# Altium schematic sheet DC-DC_30KW_BUCK-BOOST.SchDoc
size 1399 x 900 mm; SheetNumber: 1; SheetTotal: 1; SPICEModelCachePRJWMUZL: <root> / <DocumentId>PRJWMUZL</DocumentId> / <CacheFrame Number="0"> / <Model Name="7850_74477530_1m" Kind="CKT"> / <Text>******* / .subckt 7850_74477530_1m 1 2 / Rp 1 2 187304.915771 / Cp 1 2 4.36976277949p / Rs 1 N3 3.3 / L1 N3 2 1000u / .ends 7850_74477530_1m</Text> / </Model> / </CacheFrame> / </root>
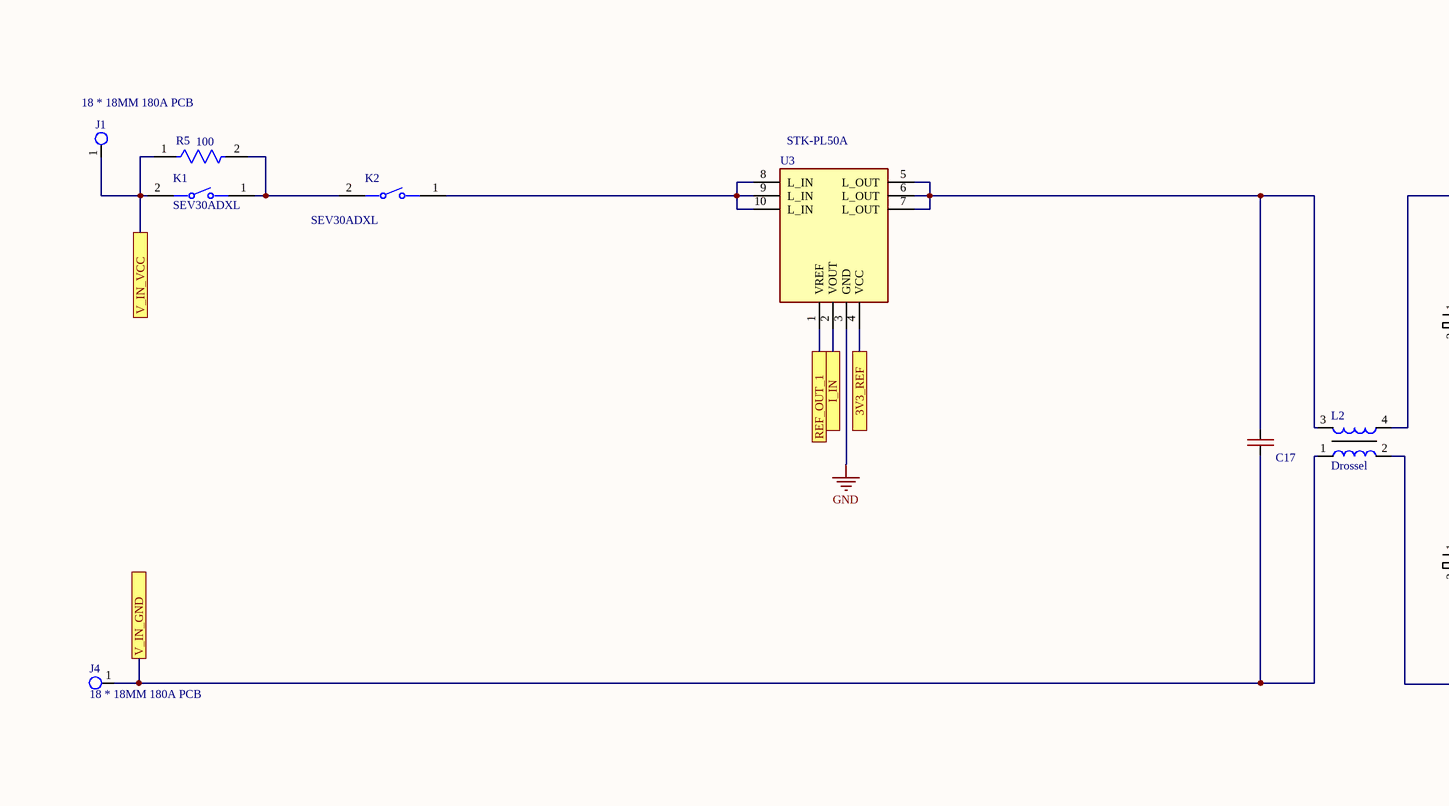
[diagram p0: DC-DC_30KW_BUCK-BOOST.SchDoc, top column 1 of 4]
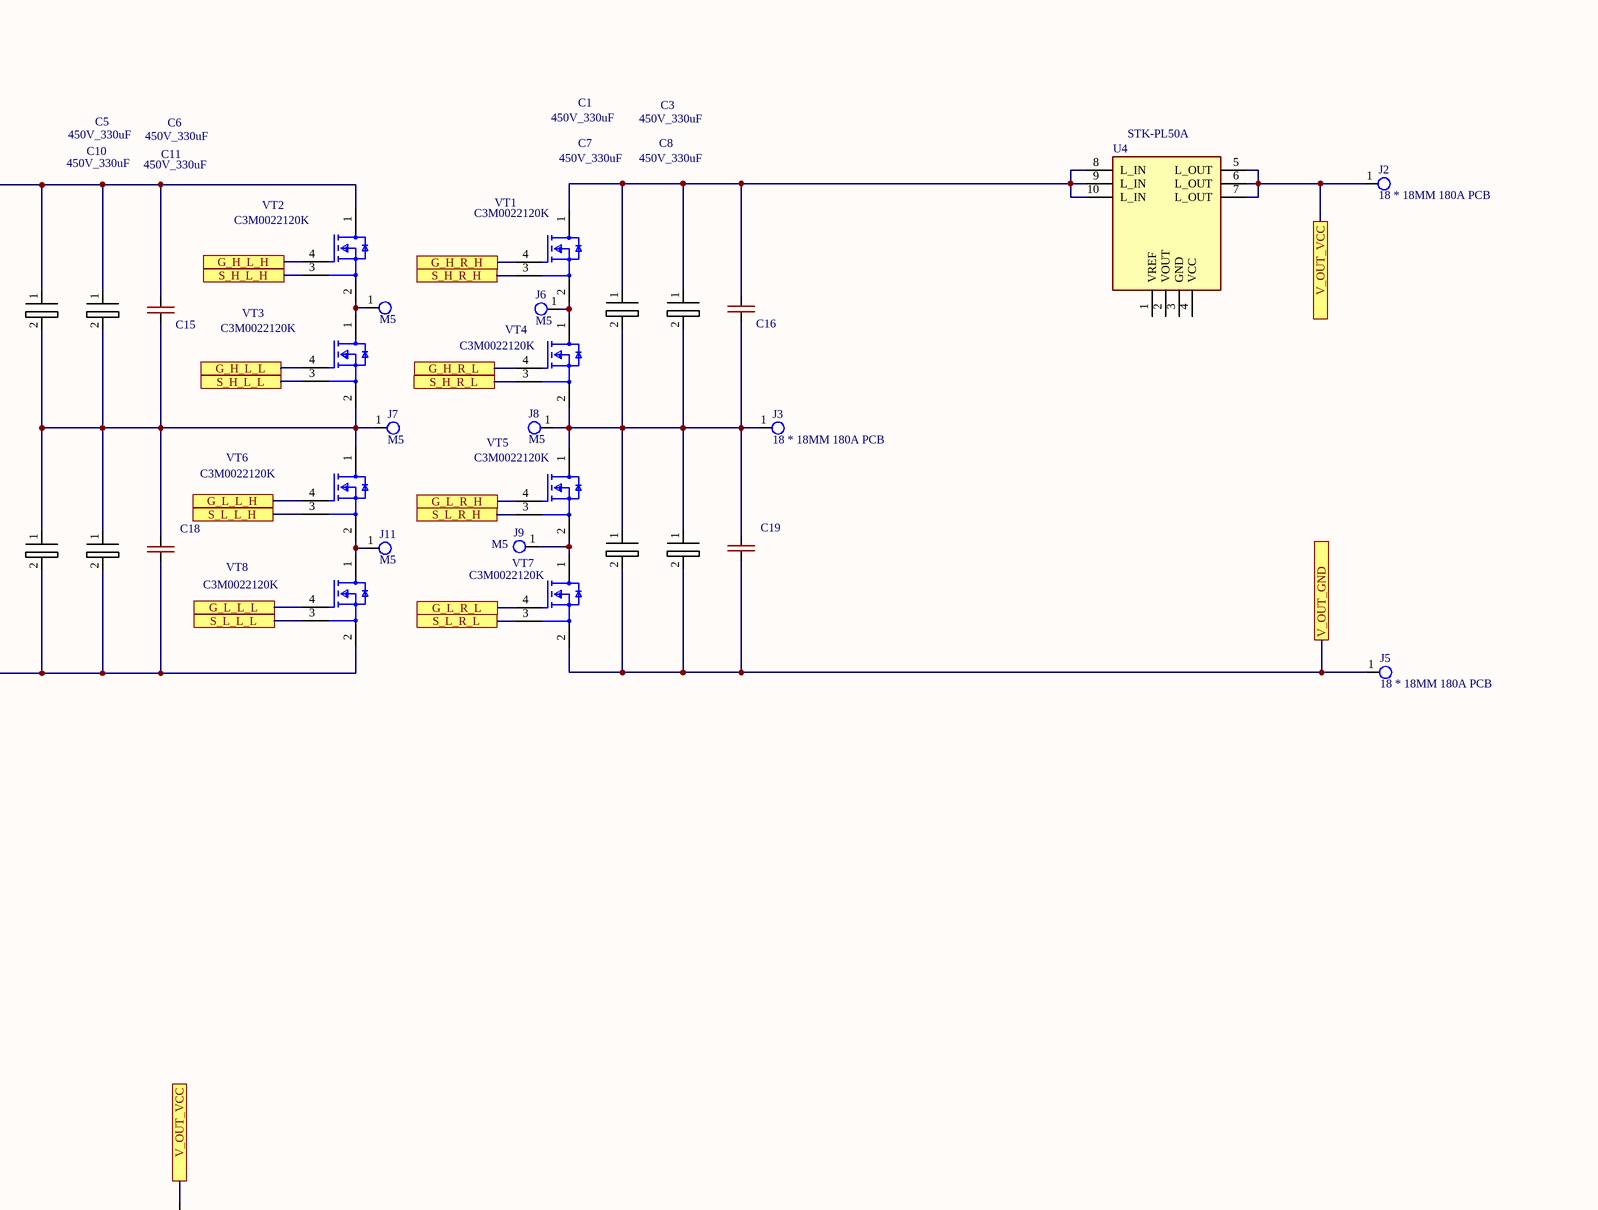
[diagram p1: DC-DC_30KW_BUCK-BOOST.SchDoc, top column 2 of 4]
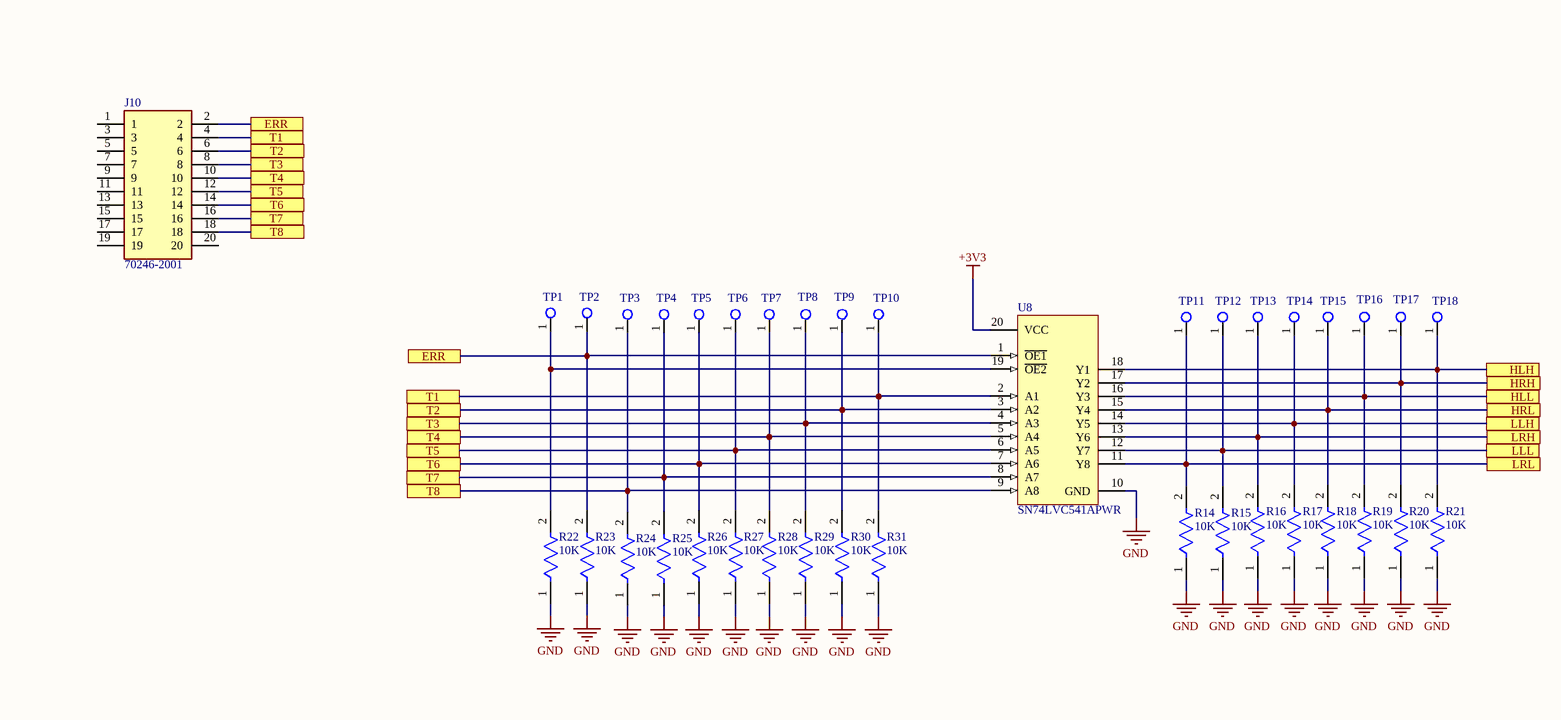
[diagram p2: DC-DC_30KW_BUCK-BOOST.SchDoc, top column 3 of 4]
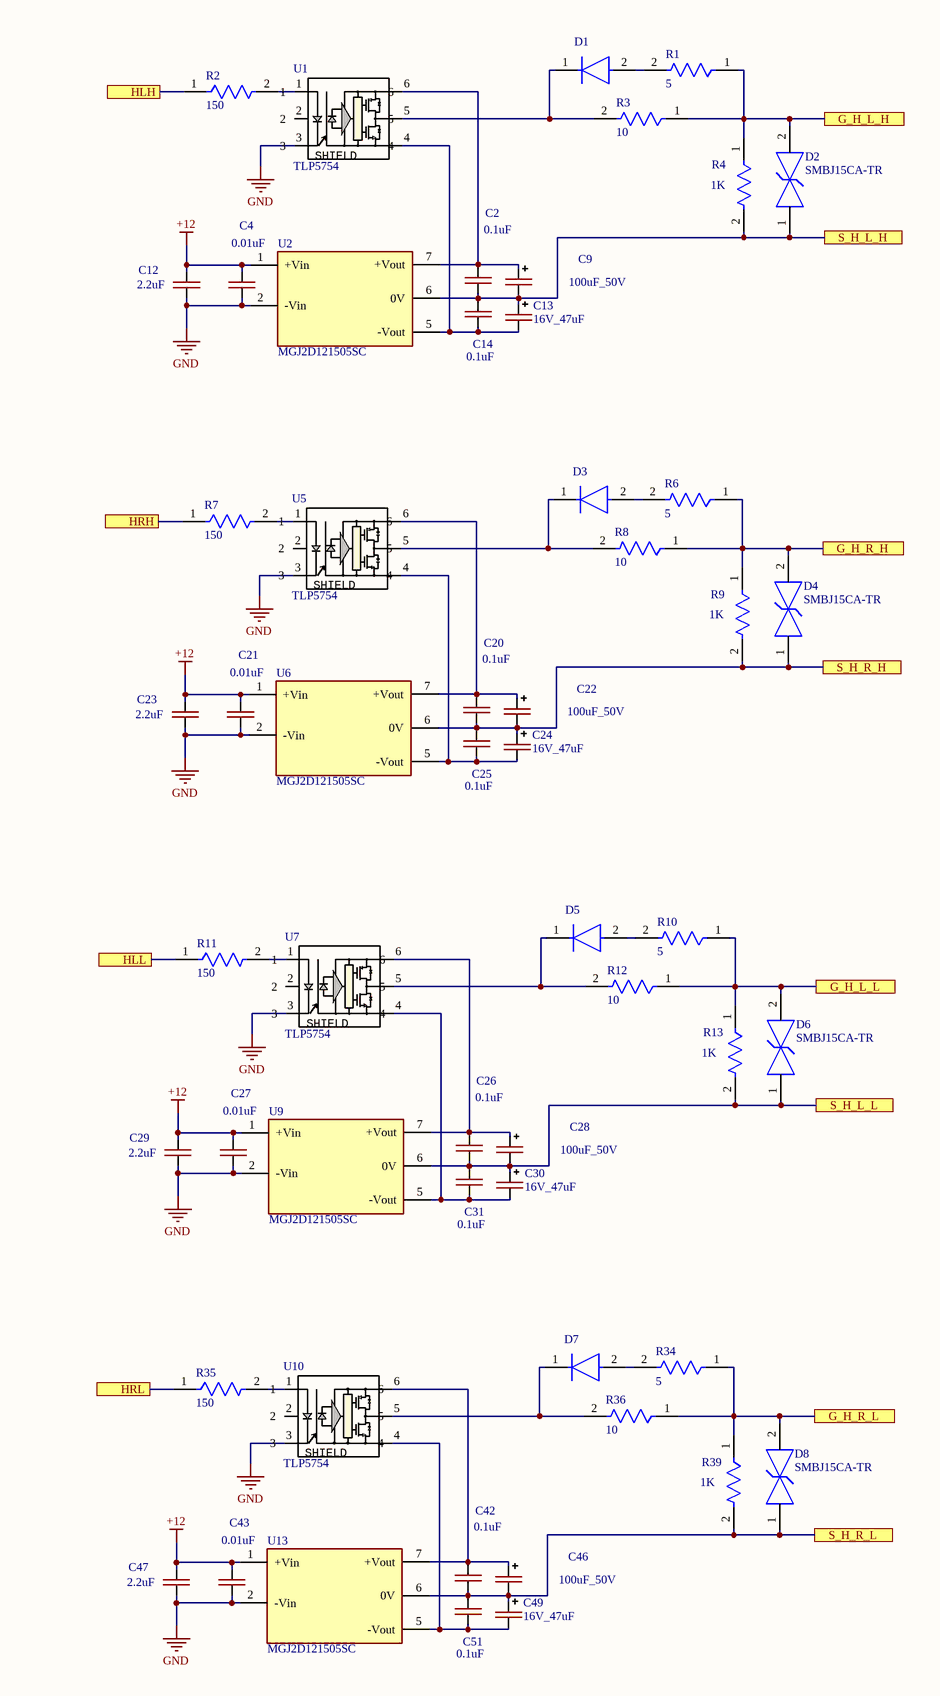
[diagram p3: DC-DC_30KW_BUCK-BOOST.SchDoc, top column 4 of 4]
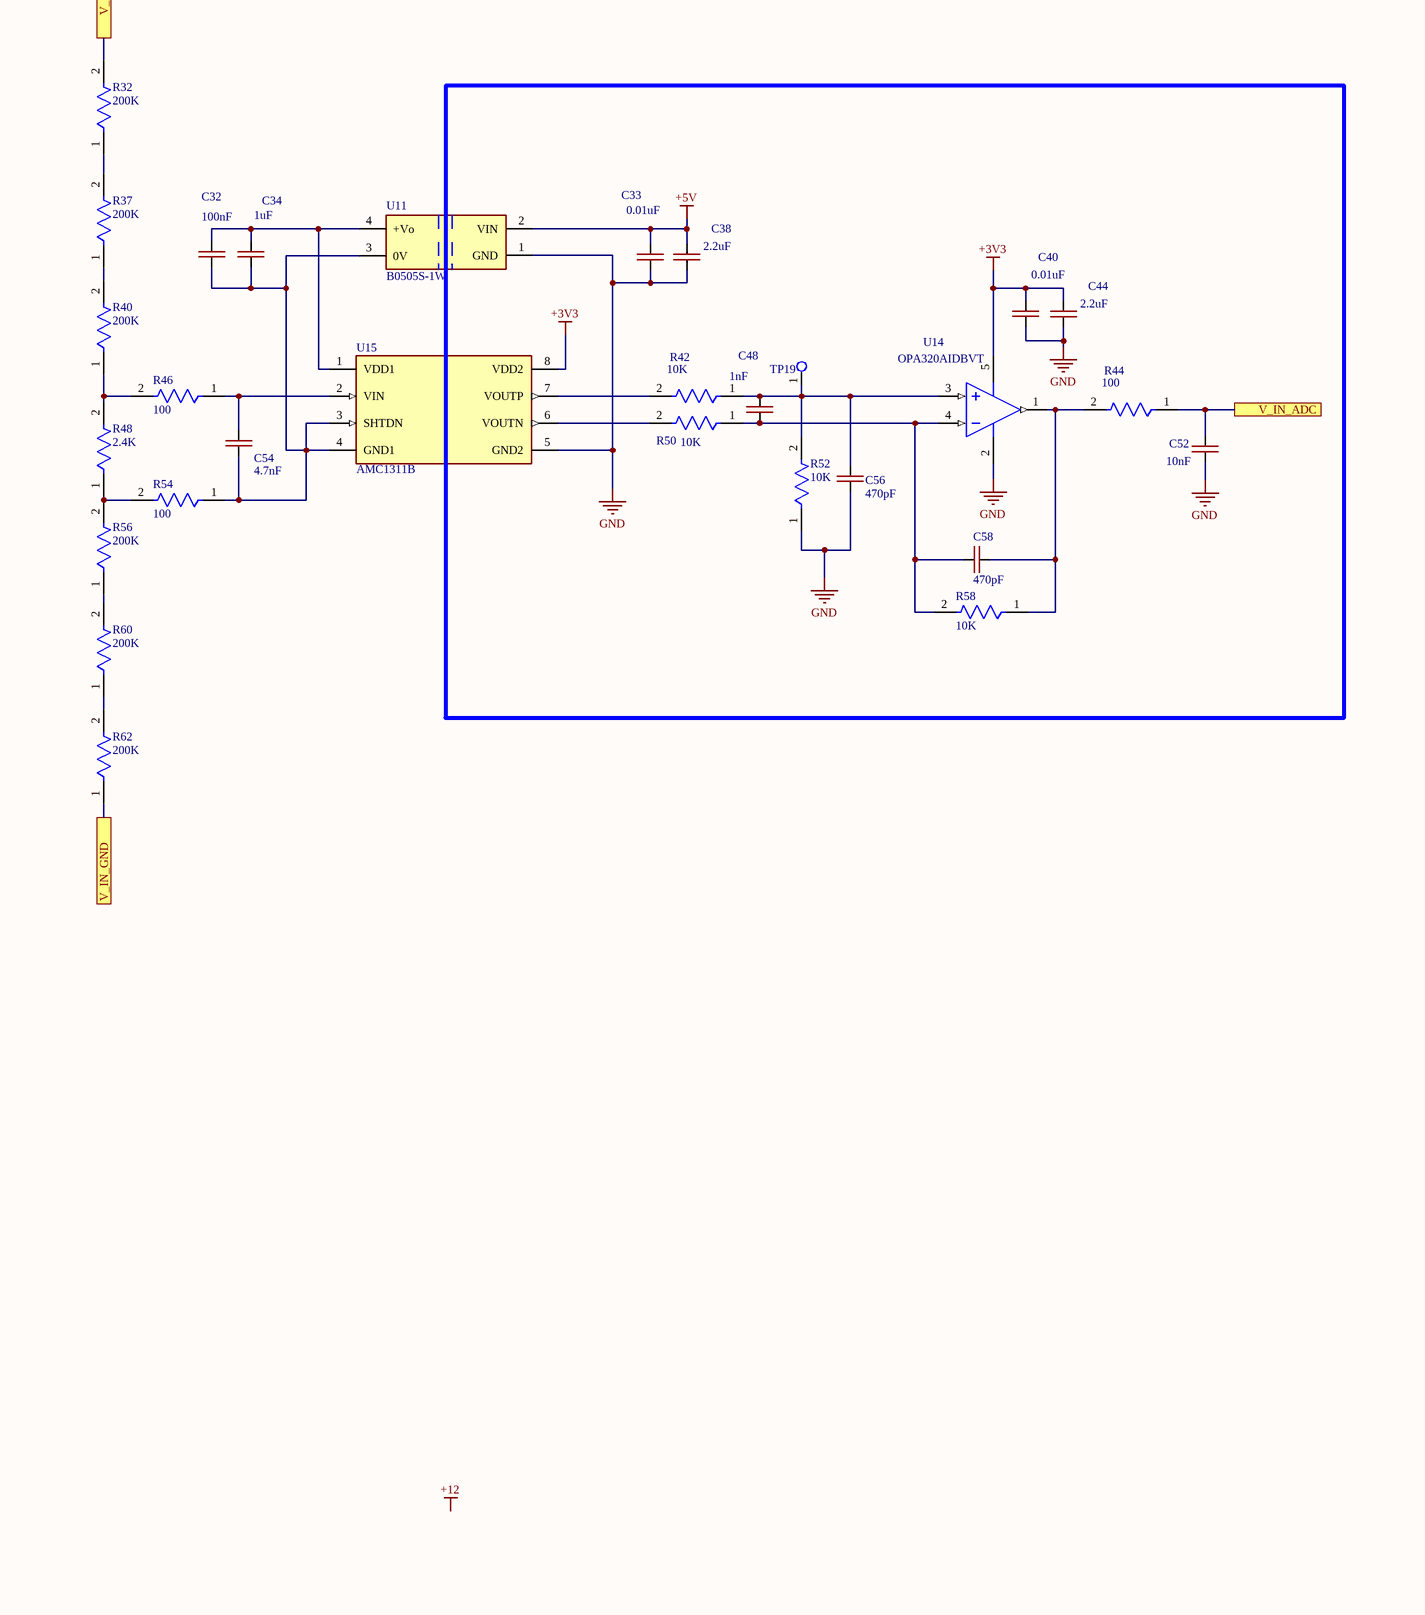
[diagram p4: DC-DC_30KW_BUCK-BOOST.SchDoc, centre column 1 of 4]
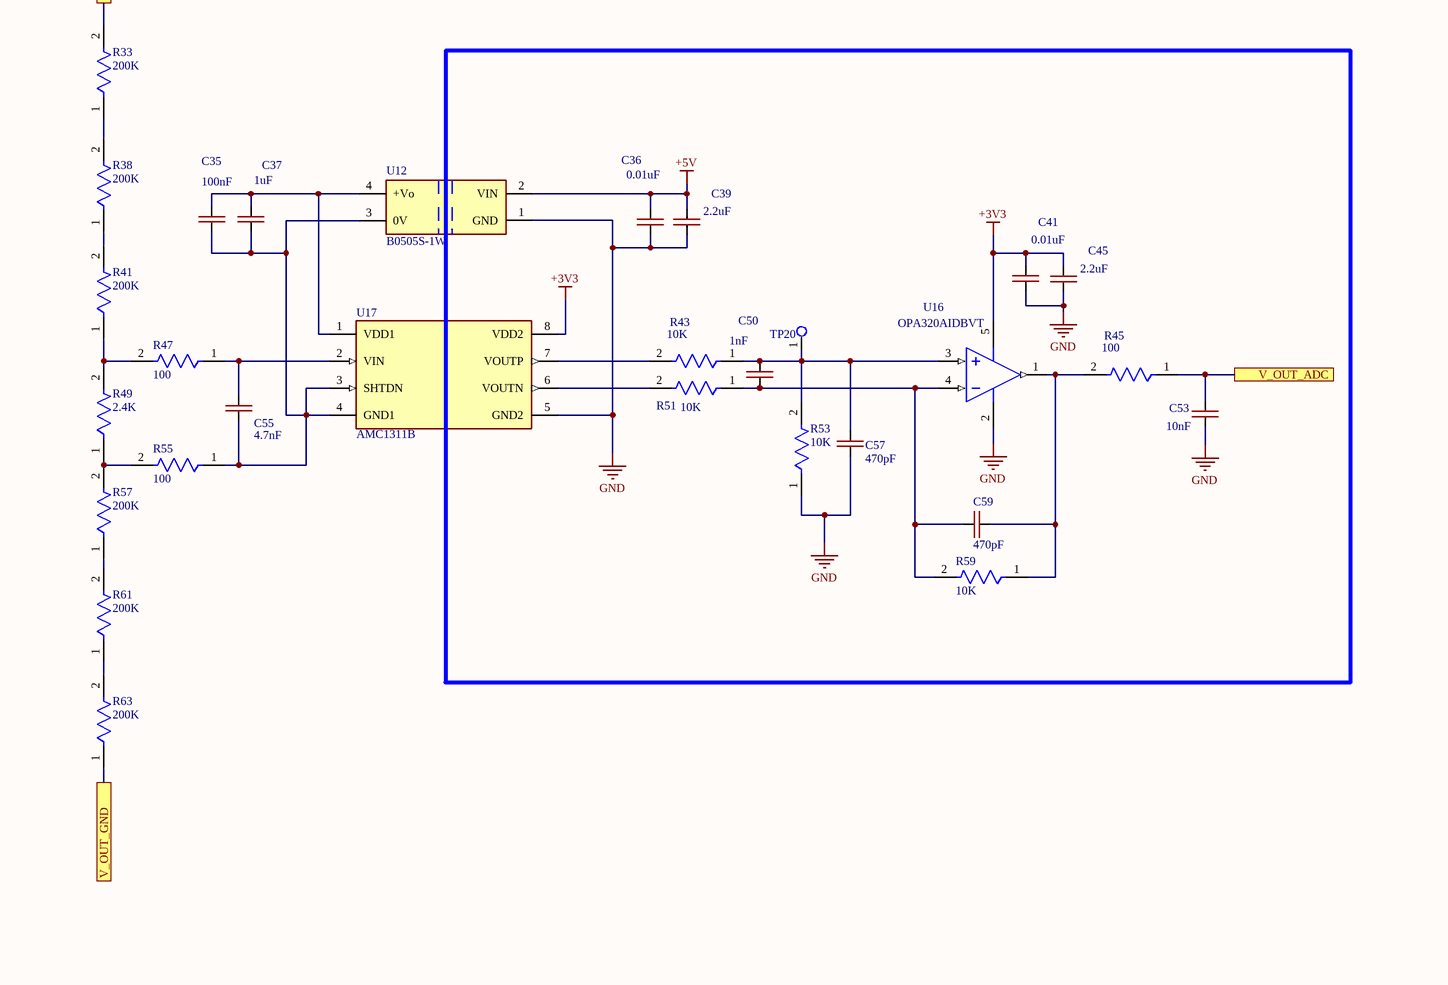
[diagram p5: DC-DC_30KW_BUCK-BOOST.SchDoc, centre column 2 of 4]
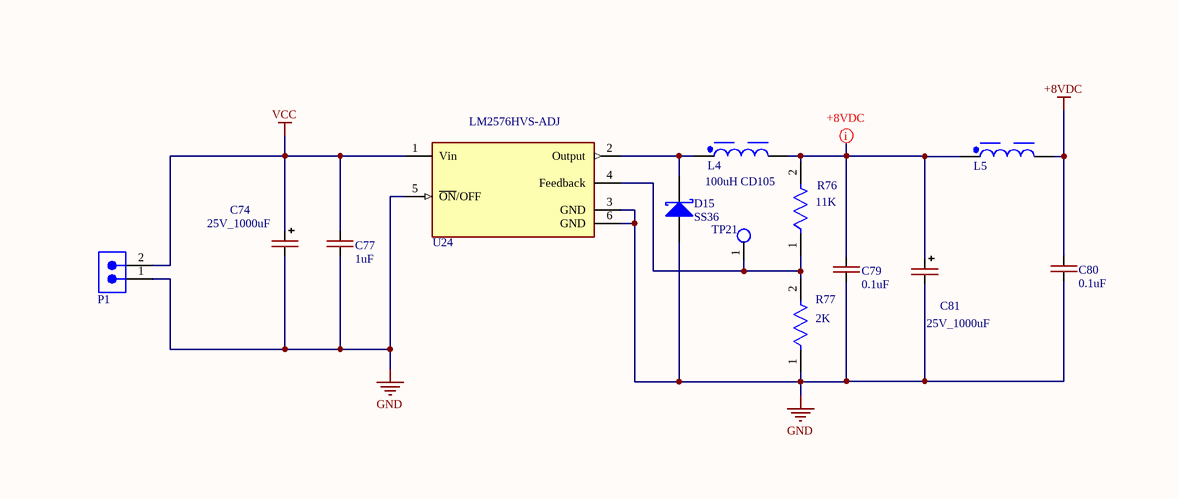
[diagram p6: DC-DC_30KW_BUCK-BOOST.SchDoc, centre column 3 of 4]
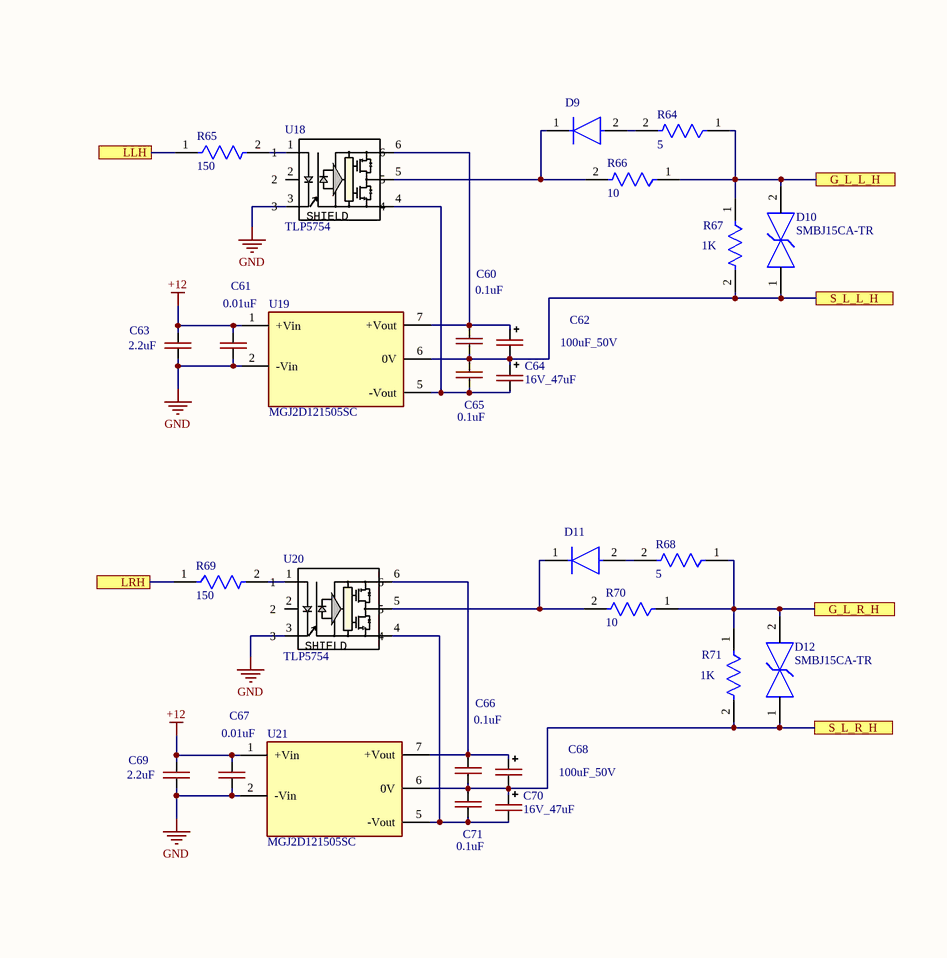
[diagram p7: DC-DC_30KW_BUCK-BOOST.SchDoc, centre column 4 of 4]
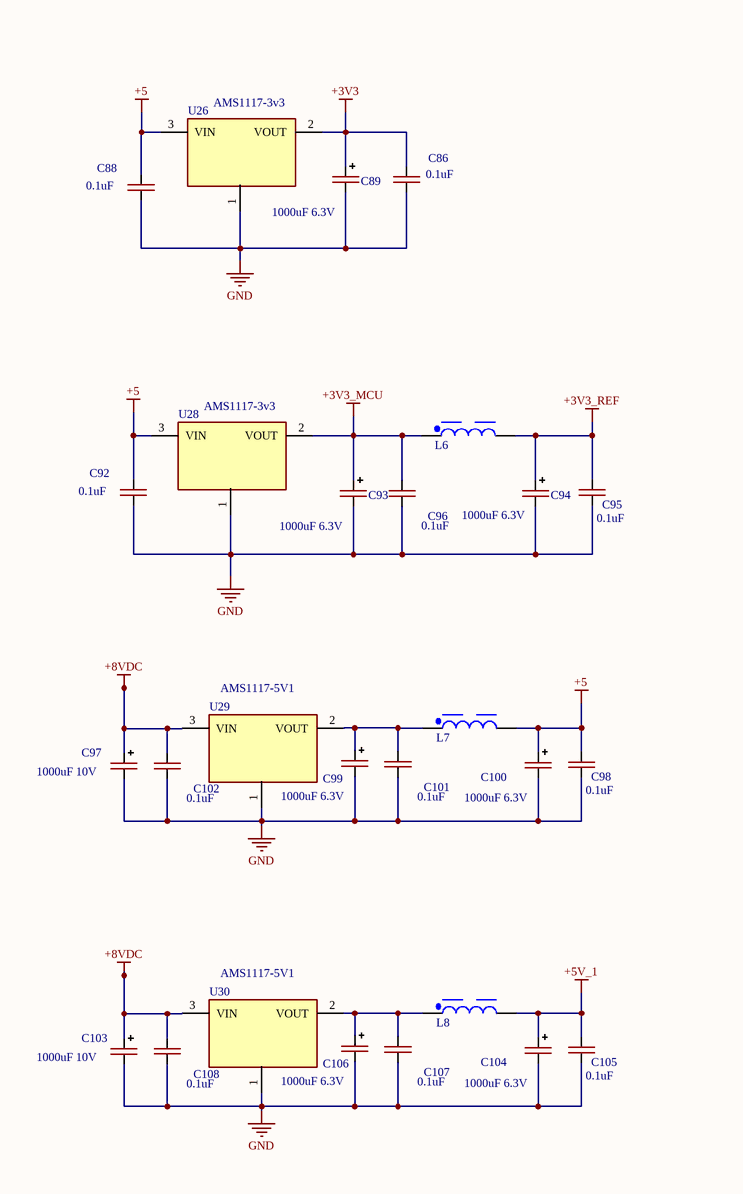
[diagram p8: DC-DC_30KW_BUCK-BOOST.SchDoc, bottom column 1 of 4]
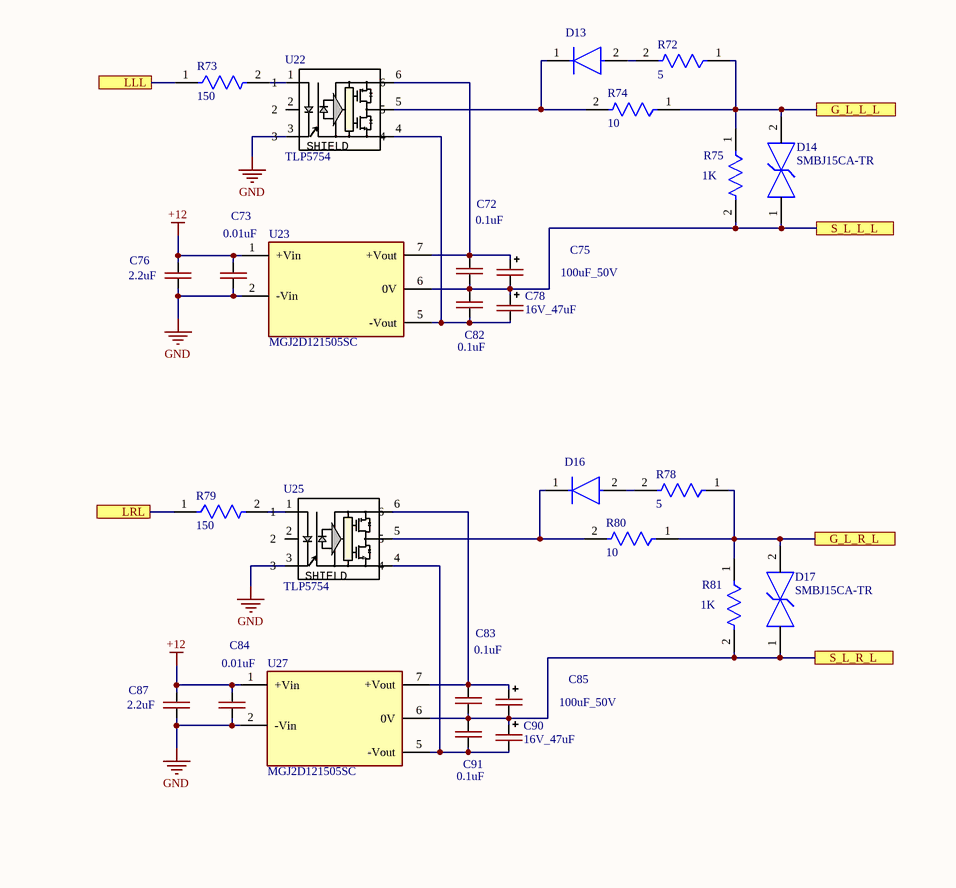
[diagram p9: DC-DC_30KW_BUCK-BOOST.SchDoc, bottom column 4 of 4]

## Parts
C1  450V_330uF  [500V_470uF]
C2  0.1uF  [CAP-0805]
C3  450V_330uF  [500V_470uF]
C4  0.01uF  [CAP-0805]
C5  450V_330uF  [500V_470uF]
C6  450V_330uF  [500V_470uF]
C7  450V_330uF  [500V_470uF]
C8  450V_330uF  [500V_470uF]
C9  100uF_50V  [CAP_SMD_Size_E]
C10  450V_330uF  [500V_470uF]
C11  450V_330uF  [500V_470uF]
C12  2.2uF  [CAP-0805]
C13  16V_47uF  [CAP-TAN-C]
C14  0.1uF  [CAP-0805]
C15  CAP-NON-POLAR  [CAP_4.7uF_630V]  (value not drawn)
C16  CAP-NON-POLAR  [CAP_4.7uF_630V]  (value not drawn)
C17  CAP-NON-POLAR  [Z121578672 77G]  (value not drawn)
C18  CAP-NON-POLAR  [CAP_4.7uF_630V]  (value not drawn)
C19  CAP-NON-POLAR  [CAP_4.7uF_630V]  (value not drawn)
C20  0.1uF  [CAP-0805]
C21  0.01uF  [CAP-0805]
C22  100uF_50V  [CAP_SMD_Size_E]
C23  2.2uF  [CAP-0805]
C24  16V_47uF  [CAP-TAN-C]
C25  0.1uF  [CAP-0805]
C26  0.1uF  [CAP-0805]
C27  0.01uF  [CAP-0805]
C28  100uF_50V  [CAP_SMD_Size_E]
C29  2.2uF  [CAP-0805]
C30  16V_47uF  [CAP-TAN-C]
C31  0.1uF  [CAP-0805]
C32  100nF  [CAP-0603]
C33  0.01uF  [CAP-0603]
C34  1uF  [CAP-0603]
C35  100nF  [CAP-0603]
C36  0.01uF  [CAP-0603]
C37  1uF  [CAP-0603]
C38  2.2uF  [CAP-0603]
C39  2.2uF  [CAP-0603]
C40  0.01uF  [CAP-0603]
C41  0.01uF  [CAP-0603]
C42  0.1uF  [CAP-0805]
C43  0.01uF  [CAP-0805]
C44  2.2uF  [CAP-0603]
C45  2.2uF  [CAP-0603]
C46  100uF_50V  [CAP_SMD_Size_E]
C47  2.2uF  [CAP-0805]
C48  1nF  [CAP-0805]
C49  16V_47uF  [CAP-TAN-C]
C50  1nF  [CAP-0805]
C51  0.1uF  [CAP-0805]
C52  10nF  [CAP-0805]
C53  10nF  [CAP-0805]
C54  4.7nF  [CAP-0603]
C55  4.7nF  [CAP-0603]
C56  470pF  [CAP-0805]
C57  470pF  [CAP-0805]
C58  470pF  [CAP-0805]
C59  470pF  [CAP-0805]
C60  0.1uF  [CAP-0805]
C61  0.01uF  [CAP-0805]
C62  100uF_50V  [CAP_SMD_Size_E]
C63  2.2uF  [CAP-0805]
C64  16V_47uF  [CAP-TAN-C]
C65  0.1uF  [CAP-0805]
C66  0.1uF  [CAP-0805]
C67  0.01uF  [CAP-0805]
C68  100uF_50V  [CAP_SMD_Size_E]
C69  2.2uF  [CAP-0805]
C70  16V_47uF  [CAP-TAN-C]
C71  0.1uF  [CAP-0805]
C72  0.1uF  [CAP-0805]
C73  0.01uF  [CAP-0805]
C74  25V_1000uF  [HITANO 3300uF 25V  16x25]
C75  100uF_50V  [CAP_SMD_Size_E]
C76  2.2uF  [CAP-0805]
C77  1uF  [CAP-0805]
C78  16V_47uF  [CAP-TAN-C]
C79  0.1uF  [CAP-0805]
C80  0.1uF  [CAP-0805]
C81  25V_1000uF  [HITANO 3300uF 25V  16x25]
C82  0.1uF  [CAP-0805]
C83  0.1uF  [CAP-0805]
C84  0.01uF  [CAP-0805]
C85  100uF_50V  [CAP_SMD_Size_E]
C86  0.1uF  [CAP-0805]
C87  2.2uF  [CAP-0805]
C88  0.1uF  [CAP-0805]
C89  1000uF 6.3V  [CAP_SMD_Size_E]
C90  16V_47uF  [CAP-TAN-C]
C91  0.1uF  [CAP-0805]
C92  0.1uF  [CAP-0805]
C93  1000uF 6.3V  [CAP_SMD_Size_E]
C94  1000uF 6.3V  [CAP_SMD_Size_E]
C95  0.1uF  [CAP-0805]
C96  0.1uF  [CAP-0805]
C97  1000uF 10V  [CAP_SMD_Size_G]
C98  0.1uF  [CAP-0805]
C99  1000uF 6.3V  [CAP_SMD_Size_E]
C100  1000uF 6.3V  [CAP_SMD_Size_E]
C101  0.1uF  [CAP-0805]
C102  0.1uF  [CAP-0805]
C103  1000uF 10V  [CAP_SMD_Size_G]
C104  1000uF 6.3V  [CAP_SMD_Size_E]
C105  0.1uF  [CAP-0805]
C106  1000uF 6.3V  [CAP_SMD_Size_E]
C107  0.1uF  [CAP-0805]
C108  0.1uF  [CAP-0805]
D1  US1G  [US1G_SMA]  (value not drawn)
D2  SMBJ15CA-TR  [FP-SMB-CA-MFG]
D3  US1G  [US1G_SMA]  (value not drawn)
D4  SMBJ15CA-TR  [FP-SMB-CA-MFG]
D5  US1G  [US1G_SMA]  (value not drawn)
D6  SMBJ15CA-TR  [FP-SMB-CA-MFG]
D7  US1G  [US1G_SMA]  (value not drawn)
D8  SMBJ15CA-TR  [FP-SMB-CA-MFG]
D9  US1G  [US1G_SMA]  (value not drawn)
D10  SMBJ15CA-TR  [FP-SMB-CA-MFG]
D11  US1G  [US1G_SMA]  (value not drawn)
D12  SMBJ15CA-TR  [FP-SMB-CA-MFG]
D13  US1G  [US1G_SMA]  (value not drawn)
D14  SMBJ15CA-TR  [FP-SMB-CA-MFG]
D15  SS36  [SMC/DO214AB]
D16  US1G  [US1G_SMA]  (value not drawn)
D17  SMBJ15CA-TR  [FP-SMB-CA-MFG]
J1  18 * 18MM 180A PCB  [M8 Conn]
J2  18 * 18MM 180A PCB  [M8 Conn]
J3  18 * 18MM 180A PCB  [M8 Conn]
J4  18 * 18MM 180A PCB  [M8 Conn]
J5  18 * 18MM 180A PCB  [M8 Conn]
J6  M5  [M5_Conn]
J7  M5  [M5_Conn]
J8  M5  [M5_Conn]
J9  M5  [M5_Conn]
J10  70246-2001  [SHDR20W99P254_2X10_3302X889X947P]
J11  M5  [M5_Conn]
K1  SEV30ADXL  [Relay_1000VDC_30A]
K2  SEV30ADXL  [Relay_1000VDC_30A]
L2  Drossel  [T47x27x15]
L4  100uH CD105  [WE-PD2_1054]
L5  100uH CD105  [WE-PD2_1054]  (value not drawn)
L6  220uH CD75  [WE-PD2_7850]  (value not drawn)
L7  220uH CD75  [WE-PD2_7850]  (value not drawn)
L8  220uH CD75  [WE-PD2_7850]  (value not drawn)
P1  691305540002  [691305540002]  (value not drawn)
R1  5  [RES-1206]
R2  150  [RES-0603]
R3  10  [RES-1206]
R4  1K  [RES-0805]
R5  100  [RES_100W_Aluminium]
R6  5  [RES-1206]
R7  150  [RES-0603]
R8  10  [RES-1206]
R9  1K  [RES-0805]
R10  5  [RES-1206]
R11  150  [RES-0603]
R12  10  [RES-1206]
R13  1K  [RES-0805]
R14  10K  [RES-0603]
R15  10K  [RES-0603]
R16  10K  [RES-0603]
R17  10K  [RES-0603]
R18  10K  [RES-0603]
R19  10K  [RES-0603]
R20  10K  [RES-0603]
R21  10K  [RES-0603]
R22  10K  [RES-0603]
R23  10K  [RES-0603]
R24  10K  [RES-0603]
R25  10K  [RES-0603]
R26  10K  [RES-0603]
R27  10K  [RES-0603]
R28  10K  [RES-0603]
R29  10K  [RES-0603]
R30  10K  [RES-0603]
R31  10K  [RES-0603]
R32  200K  [RES-1206]
R33  200K  [RES-1206]
R34  5  [RES-1206]
R35  150  [RES-0603]
R36  10  [RES-1206]
R37  200K  [RES-1206]
R38  200K  [RES-1206]
R39  1K  [RES-0805]
R40  200K  [RES-1206]
R41  200K  [RES-1206]
R42  10K  [RES-0603]
R43  10K  [RES-0603]
R44  100  [RES-0603]
R45  100  [RES-0603]
R46  100  [RES-0603]
R47  100  [RES-0603]
R48  2.4K  [RES-1206]
R49  2.4K  [RES-1206]
R50  10K  [RES-0603]
R51  10K  [RES-0603]
R52  10K  [RES-0805]
R53  10K  [RES-0805]
R54  100  [RES-0603]
R55  100  [RES-0603]
R56  200K  [RES-1206]
R57  200K  [RES-1206]
R58  10K  [RES-0805]
R59  10K  [RES-0805]
R60  200K  [RES-1206]
R61  200K  [RES-1206]
R62  200K  [RES-1206]
R63  200K  [RES-1206]
R64  5  [RES-1206]
R65  150  [RES-0603]
R66  10  [RES-1206]
R67  1K  [RES-0805]
R68  5  [RES-1206]
R69  150  [RES-0603]
R70  10  [RES-1206]
R71  1K  [RES-0805]
R72  5  [RES-1206]
R73  150  [RES-0603]
R74  10  [RES-1206]
R75  1K  [RES-0805]
R76  11K  [RES-0805]
R77  2K  [RES-0805]
R78  5  [RES-1206]
R79  150  [RES-0603]
R80  10  [RES-1206]
R81  1K  [RES-0805]
TP1  Test_Point_PCB  [Test_Point]  (value not drawn)
TP2  Test_Point_PCB  [Test_Point]  (value not drawn)
TP3  Test_Point_PCB  [Test_Point]  (value not drawn)
TP4  Test_Point_PCB  [Test_Point]  (value not drawn)
TP5  Test_Point_PCB  [Test_Point]  (value not drawn)
TP6  Test_Point_PCB  [Test_Point]  (value not drawn)
TP7  Test_Point_PCB  [Test_Point]  (value not drawn)
TP8  Test_Point_PCB  [Test_Point]  (value not drawn)
TP9  Test_Point_PCB  [Test_Point]  (value not drawn)
TP10  Test_Point_PCB  [Test_Point]  (value not drawn)
TP11  Test_Point_PCB  [Test_Point]  (value not drawn)
TP12  Test_Point_PCB  [Test_Point]  (value not drawn)
TP13  Test_Point_PCB  [Test_Point]  (value not drawn)
TP14  Test_Point_PCB  [Test_Point]  (value not drawn)
TP15  Test_Point_PCB  [Test_Point]  (value not drawn)
TP16  Test_Point_PCB  [Test_Point]  (value not drawn)
TP17  Test_Point_PCB  [Test_Point]  (value not drawn)
TP18  Test_Point_PCB  [Test_Point]  (value not drawn)
TP19  Test_Point_PCB  [Test_Point]  (value not drawn)
TP20  Test_Point_PCB  [Test_Point]  (value not drawn)
TP21  (no value)  [Test_Point]
U1  TLP5754  [SO6L_TOS]
U2  MGJ2D121505SC  [FP-MGJ2D121505SC-MFG]
U3  STK-PL50A  [STK-PL50A]
U4  STK-PL50A  [STK-PL50A]
U5  TLP5754  [SO6L_TOS]
U6  MGJ2D121505SC  [FP-MGJ2D121505SC-MFG]
U7  TLP5754  [SO6L_TOS]
U8  SN74LVC541APWR  [PW0020A_L]
U9  MGJ2D121505SC  [FP-MGJ2D121505SC-MFG]
U10  TLP5754  [SO6L_TOS]
U11  B0505S-1W  [B0505S-1W]
U12  B0505S-1W  [B0505S-1W]
U13  MGJ2D121505SC  [FP-MGJ2D121505SC-MFG]
U14  OPA320AIDBVT  [DBV0005A_M]
U15  AMC1311B  [FP-DWV0008A-MFG]
U16  OPA320AIDBVT  [DBV0005A_M]
U17  AMC1311B  [FP-DWV0008A-MFG]
U18  TLP5754  [SO6L_TOS]
U19  MGJ2D121505SC  [FP-MGJ2D121505SC-MFG]
U20  TLP5754  [SO6L_TOS]
U21  MGJ2D121505SC  [FP-MGJ2D121505SC-MFG]
U22  TLP5754  [SO6L_TOS]
U23  MGJ2D121505SC  [FP-MGJ2D121505SC-MFG]
U24  LM2576HVS-ADJ  [ON_Semiconductor_936A-02_MFG]
U25  TLP5754  [SO6L_TOS]
U26  AMS1117-3v3  [SOT-223-3]
U27  MGJ2D121505SC  [FP-MGJ2D121505SC-MFG]
U28  AMS1117-3v3  [SOT-223-3]
U29  AMS1117-5V1  [SOT-223]
U30  AMS1117-5V1  [SOT-223]
VT1  C3M0022120K  [TO247-4-BEND-SHORT]
VT2  C3M0022120K  [TO247-4-BEND-SHORT]
VT3  C3M0022120K  [TO247-4-BEND-SHORT]
VT4  C3M0022120K  [TO247-4-BEND-SHORT]
VT5  C3M0022120K  [TO247-4-BEND-SHORT]
VT6  C3M0022120K  [TO247-4-BEND-SHORT]
VT7  C3M0022120K  [TO247-4-BEND-SHORT]
VT8  C3M0022120K  [TO247-4-BEND-SHORT]
  M5  [M5_Conn]

## Ports
3V3_REF, ERR (see DC-DC_30KW_BUCK-BOOST[4A]), G_H_L_H (see DC-DC_30KW_BUCK-BOOST[2A]), G_H_L_H (see DC-DC_30KW_BUCK-BOOST[6A]), G_H_L_L (see DC-DC_30KW_BUCK-BOOST[2A]), G_H_L_L (see DC-DC_30KW_BUCK-BOOST[6A]), G_H_R_H (see DC-DC_30KW_BUCK-BOOST[2A]), G_H_R_H (see DC-DC_30KW_BUCK-BOOST[6A]), G_H_R_L (see DC-DC_30KW_BUCK-BOOST[2A]), G_H_R_L (see DC-DC_30KW_BUCK-BOOST[6B]), G_L_L_H (see DC-DC_30KW_BUCK-BOOST[2A]), G_L_L_H (see DC-DC_30KW_BUCK-BOOST[6B]), G_L_L_L (see DC-DC_30KW_BUCK-BOOST[2A]), G_L_L_L (see DC-DC_30KW_BUCK-BOOST[6C]), G_L_R_H (see DC-DC_30KW_BUCK-BOOST[2A]), G_L_R_H (see DC-DC_30KW_BUCK-BOOST[6C]), G_L_R_L (see DC-DC_30KW_BUCK-BOOST[2A]), G_L_R_L (see DC-DC_30KW_BUCK-BOOST[6C]), HLH (see DC-DC_30KW_BUCK-BOOST[5A]), HLH (see DC-DC_30KW_BUCK-BOOST[6A]), HLL (see DC-DC_30KW_BUCK-BOOST[5A]), HLL (see DC-DC_30KW_BUCK-BOOST[6A]), HRH (see DC-DC_30KW_BUCK-BOOST[5A]), HRH (see DC-DC_30KW_BUCK-BOOST[6A]), HRL (see DC-DC_30KW_BUCK-BOOST[5B]), HRL (see DC-DC_30KW_BUCK-BOOST[6B]), I_IN, LLH (see DC-DC_30KW_BUCK-BOOST[5B]), LLH (see DC-DC_30KW_BUCK-BOOST[6B]), LLL (see DC-DC_30KW_BUCK-BOOST[5B]), LLL (see DC-DC_30KW_BUCK-BOOST[6C]), LRH (see DC-DC_30KW_BUCK-BOOST[5B]), LRH (see DC-DC_30KW_BUCK-BOOST[6C]), LRL (see DC-DC_30KW_BUCK-BOOST[5B]), LRL (see DC-DC_30KW_BUCK-BOOST[6C]), REF_OUT_1, S_H_L_H (see DC-DC_30KW_BUCK-BOOST[2A]), S_H_L_H (see DC-DC_30KW_BUCK-BOOST[6A]), S_H_L_L (see DC-DC_30KW_BUCK-BOOST[2A]), S_H_L_L (see DC-DC_30KW_BUCK-BOOST[6A]), S_H_R_H (see DC-DC_30KW_BUCK-BOOST[2A]), S_H_R_H (see DC-DC_30KW_BUCK-BOOST[6A]), S_H_R_L (see DC-DC_30KW_BUCK-BOOST[2A]), S_H_R_L (see DC-DC_30KW_BUCK-BOOST[6B]), S_L_L_H (see DC-DC_30KW_BUCK-BOOST[2A]), S_L_L_H (see DC-DC_30KW_BUCK-BOOST[6B]), S_L_L_L (see DC-DC_30KW_BUCK-BOOST[2A]), S_L_L_L (see DC-DC_30KW_BUCK-BOOST[6C]), S_L_R_H (see DC-DC_30KW_BUCK-BOOST[2A]), S_L_R_H (see DC-DC_30KW_BUCK-BOOST[6C]), S_L_R_L (see DC-DC_30KW_BUCK-BOOST[2A]), S_L_R_L (see DC-DC_30KW_BUCK-BOOST[6D]), T1 (see DC-DC_30KW_BUCK-BOOST[4A]), T2 (see DC-DC_30KW_BUCK-BOOST[4A]), T2 (see DC-DC_30KW_BUCK-BOOST[4B]), T3 (see DC-DC_30KW_BUCK-BOOST[4A]), T3 (see DC-DC_30KW_BUCK-BOOST[4B]), T4 (see DC-DC_30KW_BUCK-BOOST[4A]), T4 (see DC-DC_30KW_BUCK-BOOST[4B]), T5 (see DC-DC_30KW_BUCK-BOOST[4A]), T5 (see DC-DC_30KW_BUCK-BOOST[4B]), T6 (see DC-DC_30KW_BUCK-BOOST[4A]), T6 (see DC-DC_30KW_BUCK-BOOST[4B]), T7 (see DC-DC_30KW_BUCK-BOOST[4A]), T7 (see DC-DC_30KW_BUCK-BOOST[4B]), T8 (see DC-DC_30KW_BUCK-BOOST[4A]), T8 (see DC-DC_30KW_BUCK-BOOST[4B]), V_IN_ADC, V_IN_GND (see DC-DC_30KW_BUCK-BOOST[1A]), V_IN_GND (see DC-DC_30KW_BUCK-BOOST[1B]), V_IN_VCC (see DC-DC_30KW_BUCK-BOOST[1A]), V_IN_VCC (see DC-DC_30KW_BUCK-BOOST[1B]), V_OUT_ADC, V_OUT_GND (see DC-DC_30KW_BUCK-BOOST[2B]), V_OUT_GND (see DC-DC_30KW_BUCK-BOOST[3A]), V_OUT_VCC (see DC-DC_30KW_BUCK-BOOST[2B]), V_OUT_VCC (see DC-DC_30KW_BUCK-BOOST[3A])

## Nets
+3V3: C40.2 C41.2 C44.2 C45.2 C86.2 C89.1(+) U8.20(VCC) U14.5(V+) U15.8(VDD2) U16.5(V+) U17.8(VDD2) U26.2(VOUT)
+3V3_MCU: C93.1(+) C96.2 L6.1 U28.2(VOUT)
+3V3_REF: C94.1(+) C95.2 L6.2
+5: C88.2 C92.2 C98.2 C100.1(+) L7.2 U26.3(VIN) U28.3(VIN)
+5V: C33.2 C36.2 C38.2 C39.2 U11.2(VIN) U12.2(VIN)
+5V_1: C104.1(+) C105.2 L8.2
+8VDC: C80.2 C97.1(+) C102.2 C103.1(+) C108.2 L5.2 U29.3(VIN) U30.3(VIN)
+12: C4.2 C12.2 C21.2 C23.2 C27.2 C29.2 C43.2 C47.2 C61.2 C63.2 C67.2 C69.2 C73.2 C76.2 C84.2 C87.2 U2.1(+Vin) U6.1(+Vin) U9.1(+Vin) U13.1(+Vin) U19.1(+Vin) U21.1(+Vin) U23.1(+Vin) U27.1(+Vin)
GND: C4.1 C12.1 C21.1 C23.1 C27.1 C29.1 C33.1 C36.1 C38.1 C39.1 C40.1 C41.1 C43.1 C44.1 C45.1 C47.1 C52.1 C53.1 C56.1 C57.1 C61.1 C63.1 C67.1 C69.1 C73.1 C74.2(-) C76.1 C77.1 C79.1 C80.1 C81.2(-) C84.1 C86.1 C87.1 C88.1 C89.2(-) C92.1 C93.2(-) C94.2(-) C95.1 C96.1 C97.2(-) C98.1 C99.2(-) C100.2(-) C101.1 C102.1 C103.2(-) C104.2(-) C105.1 C106.2(-) C107.1 C108.1 D15.2(A) P1.1 R14.1 R15.1 R16.1 R17.1 R18.1 R19.1 R20.1 R21.1 R22.1 R23.1 R24.1 R25.1 R26.1 R27.1 R28.1 R29.1 R30.1 R31.1 R52.1 R53.1 R77.1 U1.3 U2.2(-Vin) U3.3(GND) U5.3 U6.2(-Vin) U7.3 U8.10(GND) U9.2(-Vin) U10.3 U11.1(GND) U12.1(GND) U13.2(-Vin) U14.2(V-) U15.5(GND2) U16.2(V-) U17.5(GND2) U18.3 U19.2(-Vin) U20.3 U21.2(-Vin) U22.3 U23.2(-Vin) U24.3(GND) U24.5(~{ON}/OFF) U24.6(GND) U25.3 U26.1(Ground) U27.2(-Vin) U28.1(Ground) U29.1(Ground) U30.1(Ground)
VCC: C74.1(+) C77.2 P1.2 U24.1(Vin)
3V3_REF: U3.4(VCC) ; port 3V3_REF
ERR: J10.2 R23.2 TP2.1(G9) U8.1(~{OE1}) ; port ERR
G_H_L_H: D2.2 R1.1 R3.1 R4.1 VT2.4(Gate) ; port G_H_L_H
G_H_L_L: D6.2 R10.1 R12.1 R13.1 VT3.4(Gate) ; port G_H_L_L
G_H_R_H: D4.2 R6.1 R8.1 R9.1 VT1.4(Gate) ; port G_H_R_H
G_H_R_L: D8.2 R34.1 R36.1 R39.1 VT4.4(Gate) ; port G_H_R_L
G_L_L_H: D10.2 R64.1 R66.1 R67.1 VT6.4(Gate) ; port G_L_L_H
G_L_L_L: D14.2 R72.1 R74.1 R75.1 VT8.4(Gate) ; port G_L_L_L
G_L_R_H: D12.2 R68.1 R70.1 R71.1 VT5.4(Gate) ; port G_L_R_H
G_L_R_L: D17.2 R78.1 R80.1 R81.1 VT7.4(Gate) ; port G_L_R_L
HLH: R2.1 R21.2 TP18.1(G9) U8.18(Y1) ; port HLH
HLL: R11.1 R19.2 TP16.1(G9) U8.16(Y3) ; port HLL
HRH: R7.1 R20.2 TP17.1(G9) U8.17(Y2) ; port HRH
HRL: R18.2 R35.1 TP15.1(G9) U8.15(Y4) ; port HRL
I_IN: U3.2(VOUT) ; port I_IN
LLH: R17.2 R65.1 TP14.1(G9) U8.14(Y5) ; port LLH
LLL: R15.2 R73.1 TP12.1(G9) U8.12(Y7) ; port LLL
LRH: R16.2 R69.1 TP13.1(G9) U8.13(Y6) ; port LRH
LRL: R14.2 R79.1 TP11.1(G9) U8.11(Y8) ; port LRL
REF_OUT_1: U3.1(VREF) ; port REF_OUT_1
S_H_L_H: C2.1 C9.2(-) C13.1(+) C14.2 D2.1 R4.2 U2.6(0V) VT2.3(Driver_Source) ; port S_H_L_H
S_H_L_L: C26.1 C28.2(-) C30.1(+) C31.2 D6.1 R13.2 U9.6(0V) VT3.3(Driver_Source) ; port S_H_L_L
S_H_R_H: C20.1 C22.2(-) C24.1(+) C25.2 D4.1 R9.2 U6.6(0V) VT1.3(Driver_Source) ; port S_H_R_H
S_H_R_L: C42.1 C46.2(-) C49.1(+) C51.2 D8.1 R39.2 U13.6(0V) VT4.3(Driver_Source) ; port S_H_R_L
S_L_L_H: C60.1 C62.2(-) C64.1(+) C65.2 D10.1 R67.2 U19.6(0V) VT6.3(Driver_Source) ; port S_L_L_H
S_L_L_L: C72.1 C75.2(-) C78.1(+) C82.2 D14.1 R75.2 U23.6(0V) VT8.3(Driver_Source) ; port S_L_L_L
S_L_R_H: C66.1 C68.2(-) C70.1(+) C71.2 D12.1 R71.2 U21.6(0V) VT5.3(Driver_Source) ; port S_L_R_H
S_L_R_L: C83.1 C85.2(-) C90.1(+) C91.2 D17.1 R81.2 U27.6(0V) VT7.3(Driver_Source) ; port S_L_R_L
T1: J10.4 R31.2 TP10.1(G9) U8.2(A1) ; port T1
T2: J10.6 R30.2 TP9.1(G9) U8.3(A2) ; port T2
T3: J10.8 R29.2 TP8.1(G9) U8.4(A3) ; port T3
T4: J10.10 R28.2 TP7.1(G9) U8.5(A4) ; port T4
T5: J10.12 R27.2 TP6.1(G9) U8.6(A5) ; port T5
T6: J10.14 R26.2 TP5.1(G9) U8.7(A6) ; port T6
T7: J10.16 R25.2 TP4.1(G9) U8.8(A7) ; port T7
T8: J10.18 R24.2 TP3.1(G9) U8.9(A8) ; port T8
V_IN_ADC: C52.2 R44.1 ; port V_IN_ADC
V_IN_GND: C17.1 J4.1 L2.1 R62.1 ; port V_IN_GND
V_IN_VCC: J1.1 K1.2 R5.1 R32.2 ; port V_IN_VCC
V_OUT_ADC: C53.2 R45.1 ; port V_OUT_ADC
V_OUT_GND: C1.2 C3.2 C19.1 J5.1 R63.1 VT7.2(Power_Source) ; port V_OUT_GND
V_OUT_VCC: J2.1 R33.2 U4.5(L_OUT) U4.6(L_OUT) U4.7(L_OUT) ; port V_OUT_VCC
NetC1_1: C1.1 C3.1 C7.2 C8.2 C16.1 C19.2 J3.1 J8.1 VT4.2(Power_Source) VT5.1(Drain)
NetC2_2: C2.2 C9.1(+) U1.6 U2.7(+Vout)
NetC5_1: C5.1 C10.1 C15.2 L2.4 VT2.1(Drain)
NetC5_2: C5.2 C6.1 C10.2 C11.1 C15.1 C18.2 J7.1 VT3.2(Power_Source) VT6.1(Drain)
NetC6_2: C6.2 C11.2 C18.1 L2.2 VT8.2(Power_Source)
NetC7_1: C7.1 C8.1 C16.2 U4.8(L_IN) U4.9(L_IN) U4.10(L_IN) VT1.1(Drain)
NetC13_2: C13.2(-) C14.1 U1.4 U2.5(-Vout)
NetC17_2: C17.2 L2.3 U3.5(L_OUT) U3.6(L_OUT) U3.7(L_OUT)
NetC20_2: C20.2 C22.1(+) U5.6 U6.7(+Vout)
NetC24_2: C24.2(-) C25.1 U5.4 U6.5(-Vout)
NetC26_2: C26.2 C28.1(+) U7.6 U9.7(+Vout)
NetC30_2: C30.2(-) C31.1 U7.4 U9.5(-Vout)
NetC32_1: C32.1 C34.1 C54.1 R54.1 U11.3(0V) U15.3(SHTDN) U15.4(GND1)
NetC32_2: C32.2 C34.2 U11.4(+Vo) U15.1(VDD1)
NetC35_1: C35.1 C37.1 C55.1 R55.1 U12.3(0V) U17.3(SHTDN) U17.4(GND1)
NetC35_2: C35.2 C37.2 U12.4(+Vo) U17.1(VDD1)
NetC42_2: C42.2 C46.1(+) U10.6 U13.7(+Vout)
NetC48_1: C48.1 C58.2 R50.1 R58.2 U14.4(IN-)
NetC48_2: C48.2 C56.2 R42.1 R52.2 TP19.1(G9) U14.3(IN+)
NetC49_2: C49.2(-) C51.1 U10.4 U13.5(-Vout)
NetC50_1: C50.1 C59.2 R51.1 R59.2 U16.4(IN-)
NetC50_2: C50.2 C57.2 R43.1 R53.2 TP20.1(G9) U16.3(IN+)
NetC54_2: C54.2 R46.1 U15.2(VIN)
NetC55_2: C55.2 R47.1 U17.2(VIN)
NetC58_1: C58.1 R44.2 R58.1 U14.1(OUT)
NetC59_1: C59.1 R45.2 R59.1 U16.1(OUT)
NetC60_2: C60.2 C62.1(+) U18.6 U19.7(+Vout)
NetC64_2: C64.2(-) C65.1 U18.4 U19.5(-Vout)
NetC66_2: C66.2 C68.1(+) U20.6 U21.7(+Vout)
NetC70_2: C70.2(-) C71.1 U20.4 U21.5(-Vout)
NetC72_2: C72.2 C75.1(+) U22.6 U23.7(+Vout)
NetC78_2: C78.2(-) C82.1 U22.4 U23.5(-Vout)
NetC79_2: C79.2 C81.1(+) L4.2 L5.1 R76.2
NetC83_2: C83.2 C85.1(+) U25.6 U27.7(+Vout)
NetC90_2: C90.2(-) C91.1 U25.4 U27.5(-Vout)
NetC99_1: C99.1(+) C101.2 L7.1 U29.2(VOUT)
NetC106_1: C106.1(+) C107.2 L8.1 U30.2(VOUT)
NetD1_1: D1.1(C) R3.2 U1.5
NetD1_2: D1.2(A) R1.2
NetD3_1: D3.1(C) R8.2 U5.5
NetD3_2: D3.2(A) R6.2
NetD5_1: D5.1(C) R12.2 U7.5
NetD5_2: D5.2(A) R10.2
NetD7_1: D7.1(C) R36.2 U10.5
NetD7_2: D7.2(A) R34.2
NetD9_1: D9.1(C) R66.2 U18.5
NetD9_2: D9.2(A) R64.2
NetD11_1: D11.1(C) R70.2 U20.5
NetD11_2: D11.2(A) R68.2
NetD13_1: D13.1(C) R74.2 U22.5
NetD13_2: D13.2(A) R72.2
NetD15_1: D15.1(K) L4.1 U24.2(Output)
NetD16_1: D16.1(C) R80.2 U25.5
NetD16_2: D16.2(A) R78.2
NetJ6_1: J6.1 VT1.2(Power_Source) VT4.1(Drain)
NetJ9_1: J9.1 VT5.2(Power_Source) VT7.1(Drain)
NetJ11_1: J11.1 VT6.2(Power_Source) VT8.1(Drain)
NetK1_1: K1.1 K2.2 R5.2
NetK2_1: K2.1 U3.8(L_IN) U3.9(L_IN) U3.10(L_IN)
NetR2_2: R2.2 U1.1
NetR7_2: R7.2 U5.1
NetR11_2: R11.2 U7.1
NetR22_2: R22.2 TP1.1(G9) U8.19(~{OE2})
NetR32_1: R32.1 R37.2
NetR33_1: R33.1 R38.2
NetR35_2: R35.2 U10.1
NetR37_1: R37.1 R40.2
NetR38_1: R38.1 R41.2
NetR40_1: R40.1 R46.2 R48.2
NetR41_1: R41.1 R47.2 R49.2
NetR42_2: R42.2 U15.7(VOUTP)
NetR43_2: R43.2 U17.7(VOUTP)
NetR48_1: R48.1 R54.2 R56.2
NetR49_1: R49.1 R55.2 R57.2
NetR50_2: R50.2 U15.6(VOUTN)
NetR51_2: R51.2 U17.6(VOUTN)
NetR56_1: R56.1 R60.2
NetR57_1: R57.1 R61.2
NetR60_1: R60.1 R62.2
NetR61_1: R61.1 R63.2
NetR65_2: R65.2 U18.1
NetR69_2: R69.2 U20.1
NetR73_2: R73.2 U22.1
NetR76_1: R76.1 R77.2 TP21.1(G9) U24.4(Feedback)
NetR79_2: R79.2 U25.1
NetVT2_2: VT2.2(Power_Source) VT3.1(Drain) .1

Not connected (* = marked no-connect by the designer): J10 1 3 5 7 9 11 13 15 17 19 20; U1 2; U4 1(VREF) 2(VOUT) 3(GND) 4(VCC); U5 2; U7 2; U10 2; U18 2; U20 2; U22 2; U25 2

## Layout directives
mark named +8VDC: NetC79_2

## Notes on the sheet
- Labels drawn without touching a wire or pin: +12
- (in symbol TLP5754) SHIELD

## Library data of the parts
C1 C3 C5-C8 C10 C11 = CAP_POL_LOW_IMP
C2 C14 C20 C25 C26 C31 C42 C51 C60 C65 C66 C71 C72 C82 C83 C91 = CAP-NON-POLAR: 0.1uF X7R
C4 C21 C27 C43 C61 C67 C73 C84 = CAP-NON-POLAR: 0.01uF X7R
C9 C13 C22 C24 C28 C30 C46 C49 C62 C64 C68 C70 C75 C78 C85 C90 = CAP_POL_SMD
C12 C23 C29 C32-C41 C44 C45 C47 C48 C50 C52-C59 C63 C69 C76 C77 C79 C80 C86-C88 C92 C95 C96 C98 C101 C102 C105 C107 C108 = CAP-NON-POLAR
C74 C81 C89 C93 C94 C97 C99 C100 C103 C104 C106 = CAP-POLAR
D15 = SS36_Schottky
J1-J5 = Klema_15_A: 18 * 18MM 180A PCB High Current Solder Terminal Copper Terminal Fastener M8 Nut
J6-J9 J11  = Klema_15_A
J10 = 70246-2001: Headers & Wire Housings 20CKT SHRD HDR; Manufacturer_Name: Molex; Geometry.Height: 9.47mm; Manufacturer_Part_Number: 70246-2001; Mouser Part Number: 538-70246-2001; Mouser Price/Stock: https://www.mouser.co.uk/ProductDetail/Molex/70246-2001?qs=L7RdmAxh%252BcMgmUPcB5dMoQ%3D%3D; Arrow Part Number: *; Arrow Price/Stock: *; Datasheet Link: https://componentsearchengine.com/Datasheets/2/70246-2001.pdf
K1 K2 = Relay: 5-1000V 30A DC Contactor Power Relay SEV30ADXL Coil 12V
L2 = Drossel_Synphaze
L4 L5 = 744776122: Manufacturer: Wurth Elektronik; Match Code: WE-PD2; Case/Size Code: 1054; DC Resistance: 0.051Ω; DC Resistance Max: 0.1Ω; Inductance: 22µH; Rated Current: 2.04A; Saturation Current: 2.07A; Self Resonant Frequency: 16MHz; Manufacturer Part Number: 744776122; Category: Unshielded Power Inductors; ComponentLink1Description: Website Link; ComponentLink1URL: https://www.we-online.com/redexpert/article/744776122?ad; ComponentLink2Description: Datasheet Link; ComponentLink2URL: https://www.we-online.com/redexpert/spec/744776122?ad; Mount: Surface Mount; Operating Temperature Max: 125°C; Operating Temperature Min: -40°C; Packaging: Tape and Reel; Length: 10mm; Width: 9mm; Height: 5.4mm
L6-L8 = 74477530: Manufacturer: Wurth Elektronik; Match Code: WE-PD2; Case/Size Code: 7850; DC Resistance: 2.78Ω; DC Resistance Max: 3.3Ω; Inductance: 1000µH; Rated Current: 0.3A; Self Resonant Frequency: 2.4MHz; Manufacturer Part Number: 74477530; Category: Unshielded Power Inductors; ComponentLink1Description: Website Link; ComponentLink1URL: https://www.we-online.com/redexpert/article/74477530?ad; ComponentLink2Description: Datasheet Link; ComponentLink2URL: https://www.we-online.com/redexpert/spec/74477530?ad; Mount: Surface Mount; Operating Temperature Max: 125°C; Operating Temperature Min: -40°C; Packaging: Tape and Reel; Length: 7.8mm; Width: 7mm; Height: 4.95mm; Saturation Current: 0.3A
P1 = 691305540002: WR-TBL Series 3055 PCB Header Horizontal Entry with Plastic Latches, THT, pitch 5.08mm, 2p; Manufacturer: Wurth Elektronik; Modularity: No; Rated Current: 16A; Working Voltage: 300V; ComponentLink1Description: Website Link; ComponentLink1URL: https://www.we-online.com/redexpert/article/691305540002?ad; ComponentLink2Description: Datasheet Link; ComponentLink2URL: https://www.we-online.com/redexpert/spec/691305540002?ad; Manufacturer Part Number: 691305540002; Category: Terminal Blocks; Match Code: WR-TBL; Mount: Through Hole; Operating Temperature Max: 105°C; Operating Temperature Min: -40°C; Packaging: Box; Application: Pluggable; Number of Pins: 2; Number of Rows: 1; Orientation: Horizontal; Pitch: 5.08mm
R1-R4 R6-R81 = RES-CONST
R5 = RES-CONST: 100W RX24 Aluminum Power Metal Shell Case Wirewound Resistor 100Omh
TP1-TP21 = TP_PCB?: Test_Point
U15 U17 = AMC1311
U24 = LM2576D2T-005G
U26 U28-U30 = AMS1117